# Altium schematic sheet FuelCellMonitor.SchDoc
size A; SheetNumber: 1; SheetTotal: 6
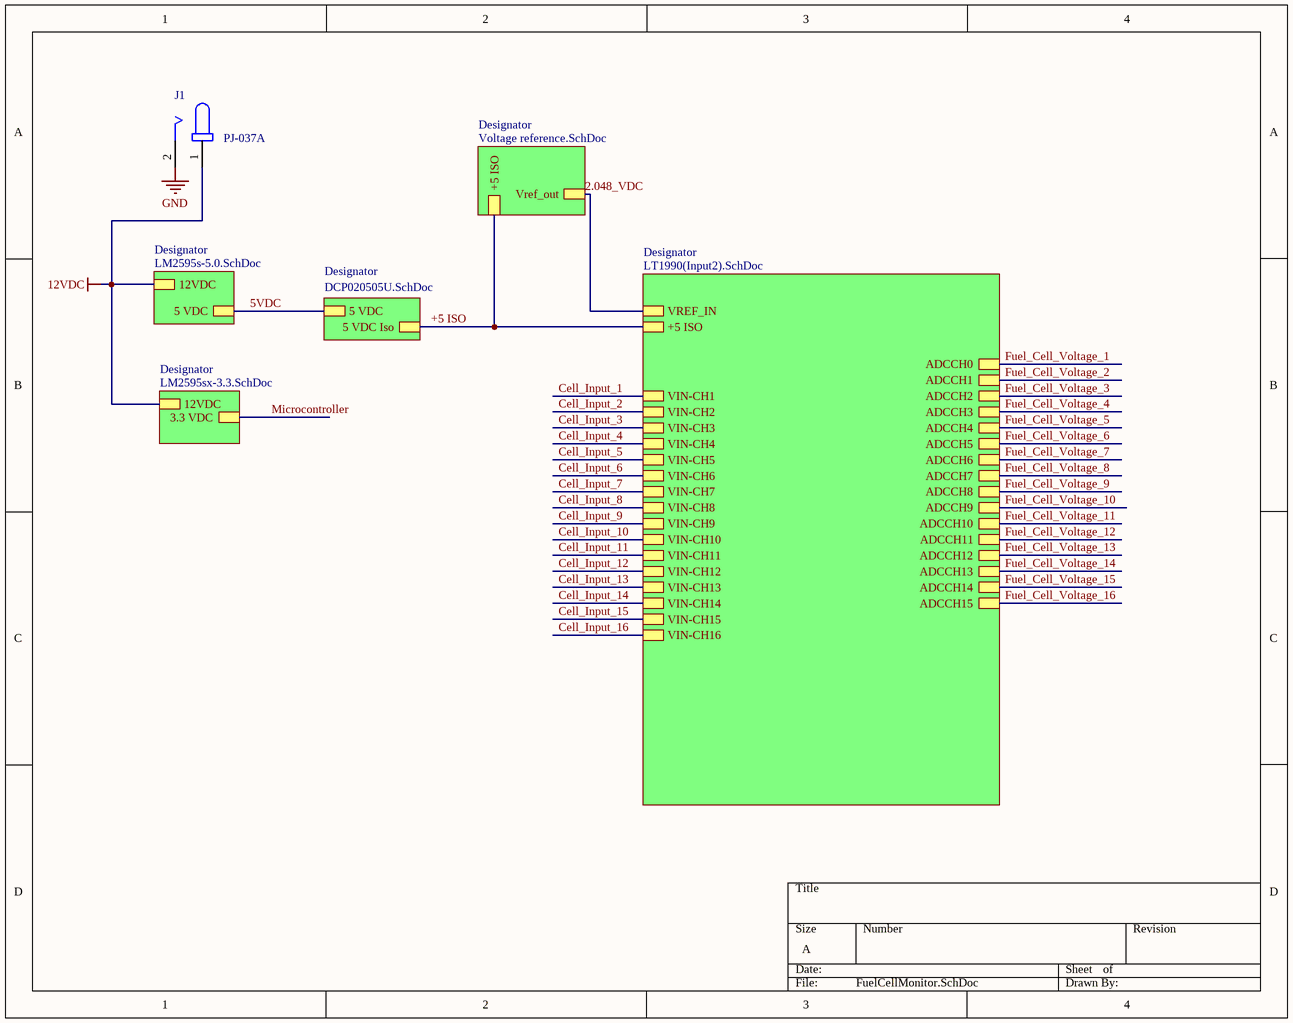
[diagram p0: FuelCellMonitor.SchDoc]

## Parts
J1  PJ-037A  [CUI_PJ-037A]

## Sub-sheets
Designator = LM2595s-5.0.SchDoc: 12VDC, 5 VDC
Designator = LM2595sx-3.3.SchDoc: 12VDC, 3.3 VDC
Designator = DCP020505U.SchDoc: 5 VDC, 5 VDC Iso
Designator = Voltage reference.SchDoc: Vref_out, +5 ISO
Designator = LT1990(Input2).SchDoc: ADCCH1, ADCCH2, ADCCH3, ADCCH4, ADCCH5, ADCCH6, ADCCH7, ADCCH8, ADCCH9, ADCCH10, ADCCH11, ADCCH12, ADCCH13, ADCCH14, ADCCH15, ADCCH0, VIN-CH3, VIN-CH4, VIN-CH5, VIN-CH6, VIN-CH8, VIN-CH9, VIN-CH10, VIN-CH11, VIN-CH12, VIN-CH13, VIN-CH14, VIN-CH15, VIN-CH16, VIN-CH2, VIN-CH1, VIN-CH7, VREF_IN, +5 ISO

## Nets
12VDC: J1.1 ; sheet Designator/12VDC, sheet Designator/12VDC
GND: J1.2
2.048_VDC: sheet Designator/Vref_out, sheet Designator/VREF_IN
5VDC: sheet Designator/5 VDC, sheet Designator/5 VDC
+5 ISO: sheet Designator/5 VDC Iso, sheet Designator/+5 ISO, sheet Designator/+5 ISO
Cell_Input_1: sheet Designator/VIN-CH1
Cell_Input_2: sheet Designator/VIN-CH2
Cell_Input_3: sheet Designator/VIN-CH3
Cell_Input_4: sheet Designator/VIN-CH4
Cell_Input_5: sheet Designator/VIN-CH5
Cell_Input_6: sheet Designator/VIN-CH6
Cell_Input_7: sheet Designator/VIN-CH7
Cell_Input_8: sheet Designator/VIN-CH8
Cell_Input_9: sheet Designator/VIN-CH9
Cell_Input_10: sheet Designator/VIN-CH10
Cell_Input_11: sheet Designator/VIN-CH11
Cell_Input_12: sheet Designator/VIN-CH12
Cell_Input_13: sheet Designator/VIN-CH13
Cell_Input_14: sheet Designator/VIN-CH14
Cell_Input_15: sheet Designator/VIN-CH15
Cell_Input_16: sheet Designator/VIN-CH16
Fuel_Cell_Voltage_1: sheet Designator/ADCCH0
Fuel_Cell_Voltage_2: sheet Designator/ADCCH1
Fuel_Cell_Voltage_3: sheet Designator/ADCCH2
Fuel_Cell_Voltage_4: sheet Designator/ADCCH3
Fuel_Cell_Voltage_5: sheet Designator/ADCCH4
Fuel_Cell_Voltage_6: sheet Designator/ADCCH5
Fuel_Cell_Voltage_7: sheet Designator/ADCCH6
Fuel_Cell_Voltage_8: sheet Designator/ADCCH7
Fuel_Cell_Voltage_9: sheet Designator/ADCCH8
Fuel_Cell_Voltage_10: sheet Designator/ADCCH9
Fuel_Cell_Voltage_11: sheet Designator/ADCCH10
Fuel_Cell_Voltage_12: sheet Designator/ADCCH11
Fuel_Cell_Voltage_13: sheet Designator/ADCCH12
Fuel_Cell_Voltage_14: sheet Designator/ADCCH13
Fuel_Cell_Voltage_15: sheet Designator/ADCCH14
Fuel_Cell_Voltage_16: sheet Designator/ADCCH15
Microcontroller: sheet Designator/3.3 VDC

## Library data of the parts
J1 = PJ-037A: 2.0 mm Center Pin, 2.5 A, Right Angle, Through Hole, Dc Power Jack Connector; Value: *; Price: None; MP: PJ-037A; Availability: Unavailable; Package: None